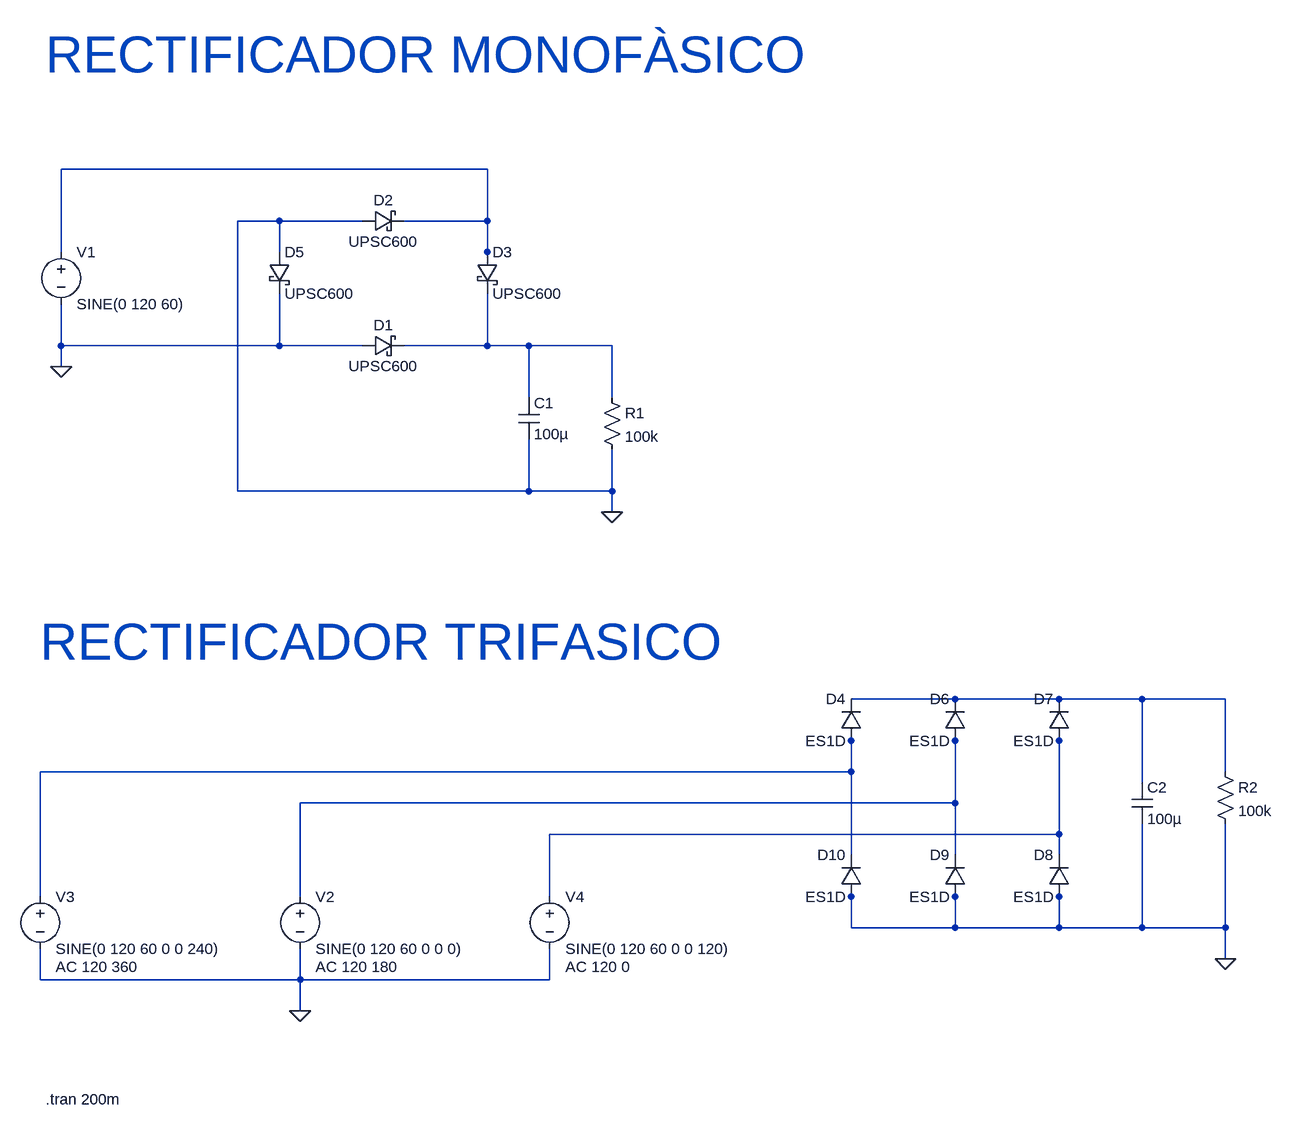
[diagram p0: schematic Rectificadores.asc]
Rectificadores.asc, the LTspice schematic file:
Version 4
SHEET 1 2684 1320
WIRE -368 -128 -1024 -128
WIRE -688 -48 -752 -48
WIRE -560 -48 -688 -48
WIRE -368 -48 -368 -128
WIRE -368 -48 -496 -48
WIRE -1024 0 -1024 -128
WIRE -688 0 -688 -48
WIRE -368 0 -368 -48
WIRE -368 16 -368 0
WIRE -1024 144 -1024 80
WIRE -688 144 -688 64
WIRE -688 144 -1024 144
WIRE -560 144 -688 144
WIRE -368 144 -368 64
WIRE -368 144 -496 144
WIRE -304 144 -368 144
WIRE -176 144 -304 144
WIRE -1024 176 -1024 144
WIRE -304 224 -304 144
WIRE -176 224 -176 144
WIRE -752 368 -752 -48
WIRE -304 368 -304 288
WIRE -304 368 -752 368
WIRE -176 368 -176 304
WIRE -176 368 -304 368
WIRE -176 400 -176 368
WIRE 352 688 192 688
WIRE 512 688 352 688
WIRE 640 688 512 688
WIRE 768 688 640 688
WIRE 192 752 192 736
WIRE 352 752 352 736
WIRE 512 752 512 736
WIRE 192 800 192 752
WIRE 192 800 -1056 800
WIRE 768 800 768 688
WIRE 640 816 640 688
WIRE 352 848 352 752
WIRE 352 848 -656 848
WIRE 512 896 512 752
WIRE 512 896 -272 896
WIRE 192 928 192 800
WIRE 352 928 352 848
WIRE 512 928 512 896
WIRE -1056 992 -1056 800
WIRE -656 992 -656 848
WIRE -272 992 -272 896
WIRE 192 992 192 976
WIRE 352 992 352 976
WIRE 512 992 512 976
WIRE 192 1040 192 992
WIRE 352 1040 352 992
WIRE 352 1040 192 1040
WIRE 512 1040 512 992
WIRE 512 1040 352 1040
WIRE 640 1040 640 880
WIRE 640 1040 512 1040
WIRE 768 1040 768 880
WIRE 768 1040 640 1040
WIRE 768 1088 768 1040
WIRE -1056 1120 -1056 1072
WIRE -656 1120 -656 1072
WIRE -656 1120 -1056 1120
WIRE -272 1120 -272 1072
WIRE -272 1120 -656 1120
WIRE -656 1168 -656 1120
FLAG -1024 176 0
FLAG -176 400 0
FLAG -656 1168 0
FLAG 768 1088 0
DATAFLAG 768 752 ""
SYMBOL voltage -1024 -16 R0
WINDOW 123 0 0 Left 0
WINDOW 39 0 0 Left 0
SYMATTR InstName V1
SYMATTR Value SINE(0 120 60)
SYMBOL schottky -560 160 R270
WINDOW 0 32 32 VTop 2
WINDOW 3 0 32 VBottom 2
SYMATTR InstName D1
SYMATTR Value UPSC600
SYMATTR Description Diode
SYMATTR Type diode
SYMBOL schottky -560 -32 R270
WINDOW 0 32 32 VTop 2
WINDOW 3 0 32 VBottom 2
SYMATTR InstName D2
SYMATTR Value UPSC600
SYMATTR Description Diode
SYMATTR Type diode
SYMBOL schottky -384 0 R0
SYMATTR InstName D3
SYMATTR Value UPSC600
SYMATTR Description Diode
SYMATTR Type diode
SYMBOL schottky -704 0 R0
SYMATTR InstName D5
SYMATTR Value UPSC600
SYMATTR Description Diode
SYMATTR Type diode
SYMBOL res -192 208 R0
SYMATTR InstName R1
SYMATTR Value 100k
SYMBOL cap -320 224 R0
SYMATTR InstName C1
SYMATTR Value 100µ
SYMATTR SpiceLine V=400
SYMBOL diode 208 752 R180
WINDOW 0 24 64 Left 2
WINDOW 3 24 0 Left 2
SYMATTR InstName D4
SYMATTR Value ES1D
SYMBOL res 752 784 R0
SYMATTR InstName R2
SYMATTR Value 100k
SYMBOL voltage -656 976 R0
WINDOW 123 24 124 Left 2
WINDOW 39 0 0 Left 0
SYMATTR InstName V2
SYMATTR Value SINE(0 120 60 0 0 0)
SYMATTR Value2 AC 120 180
SYMBOL voltage -1056 976 R0
WINDOW 123 24 124 Left 2
WINDOW 39 0 0 Left 0
SYMATTR InstName V3
SYMATTR Value SINE(0 120 60 0 0 240)
SYMATTR Value2 AC 120 360
SYMBOL voltage -272 976 R0
WINDOW 123 24 124 Left 2
WINDOW 39 0 0 Left 0
SYMATTR InstName V4
SYMATTR Value SINE(0 120 60 0 0 120)
SYMATTR Value2 AC 120 0
SYMBOL cap 624 816 R0
SYMATTR InstName C2
SYMATTR Value 100µ
SYMATTR SpiceLine V=400
SYMBOL diode 368 752 R180
WINDOW 0 24 64 Left 2
WINDOW 3 24 0 Left 2
SYMATTR InstName D6
SYMATTR Value ES1D
SYMBOL diode 528 752 R180
WINDOW 0 24 64 Left 2
WINDOW 3 24 0 Left 2
SYMATTR InstName D7
SYMATTR Value ES1D
SYMBOL diode 528 992 R180
WINDOW 0 24 64 Left 2
WINDOW 3 24 0 Left 2
SYMATTR InstName D8
SYMATTR Value ES1D
SYMBOL diode 368 992 R180
WINDOW 0 24 64 Left 2
WINDOW 3 24 0 Left 2
SYMATTR InstName D9
SYMATTR Value ES1D
SYMBOL diode 208 992 R180
WINDOW 0 24 64 Left 2
WINDOW 3 24 0 Left 2
SYMATTR InstName D10
SYMATTR Value ES1D
TEXT -1048 1304 Left 2 !.tran 200m
TEXT -1056 600 Left 6 ;RECTIFICADOR TRIFASICO
TEXT -1048 -304 Left 6 ;RECTIFICADOR MONOFÀSICO

The netlist it stands for:
* Rectificadores.asc
V1 N001 0 SINE(0 120 60)
D1 0 N002 UPSC600
D2 0 N001 UPSC600
D3 N001 N002 UPSC600
D5 0 0 UPSC600
R1 N002 0 100k
C1 N002 0 100µ V=400
D4 N004 N003 ES1D
R2 N003 0 100k
V2 N005 0 SINE(0 120 60 0 0 0) AC 120 180
V3 N004 0 SINE(0 120 60 0 0 240) AC 120 360
V4 N006 0 SINE(0 120 60 0 0 120) AC 120 0
C2 N003 0 100µ V=400
D6 N005 N003 ES1D
D7 N006 N003 ES1D
D8 0 N006 ES1D
D9 0 N005 ES1D
D10 0 N004 ES1D
.model D D
.lib standard.dio
.tran 200m
* RECTIFICADOR TRIFASICO
* RECTIFICADOR MONOFÀSICO
.backanno
.end